# EAGLE design GPS_breakout-v10 (EAGLE 6.2)
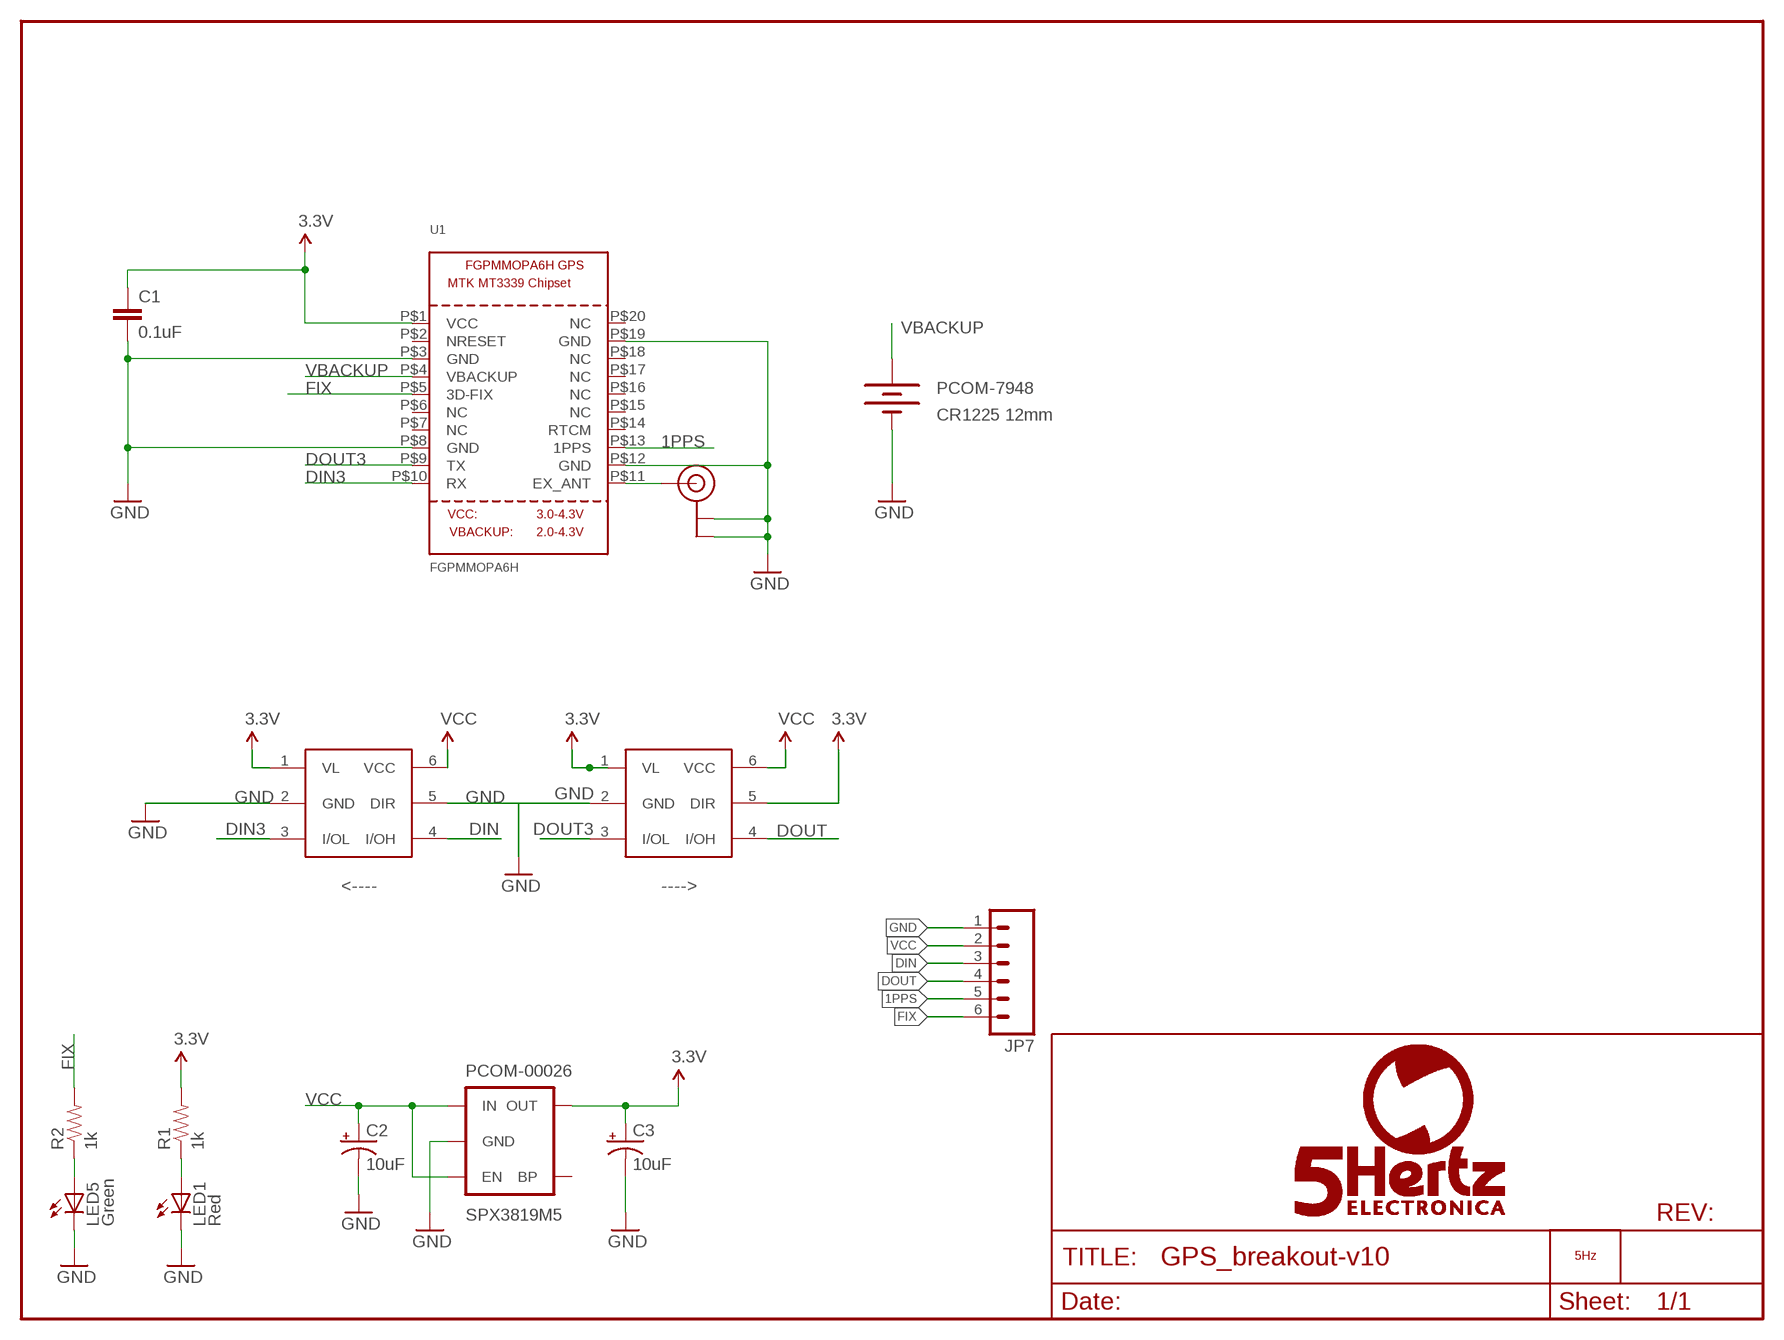
[diagram p0: schematic, sheet 1]

## Parts
C1  0.1uF  CAP0603-CAP  [0603-CAP]
C2  10uF  CAP_POL1206  [EIA3216]
C3  10uF  CAP_POL1206  [EIA3216]
JP7  M06SIP  [1X06]
LED1  Red  LED0603  [LED-0603]
LED5  Green  LED0603  [LED-0603]
LOGO1  LOGO_5HZ_MAIN_15MM  [5HZ_LOGO_MAIN_15MM]
PCOM-00026  SPX3819M5  V_REG_LDOSMD  [SOT23-5]
PCOM-7948  CR1225 12mm  BATTERY12PTH  [BATTCON_12MM_PTH]
R1  1k  RESISTOR0603-RES  [0603-RES]
R2  1k  RESISTOR0603-RES  [0603-RES]
U1  FGPMMOPA6H  GPS_FGPMMOPA6H  [FGPMMOPA6H]
U$7  MAX337  [SOT-363]
U$8  MAX337  [SOT-363]
U$20  U.FL  [U.FL]

## Nets
1PPS: JP7.5 U1.P$13(1PPS)
3.3V: C1.1 C3.A(+) PCOM-00026.5(OUT) R1.2 U1.P$1(VCC) U$7.1(VL) U$8.1(VL) U$8.5(DIR)
DIN: JP7.3 U$7.4(I/OH)
DIN3: U1.P$10(RX) U$7.3(I/OL)
DOUT: JP7.4 U$8.4(I/OH)
DOUT3: U1.P$9(TX) U$8.3(I/OL)
FIX: JP7.6 R2.2 U1.P$5(3D-FIX)
GND: C1.2 C2.C(-) C3.C(-) JP7.1 LED1.C LED5.C PCOM-00026.2(GND) PCOM-7948.GND(-) U1.P$3(GND) U1.P$8(GND) U1.P$12(GND) U1.P$19(GND) U$7.2(GND) U$7.5(DIR) U$8.2(GND) U$20.P$1(GND) U$20.P$2(GND)
N$1: LED1.A R1.1
N$7: U1.P$11(EX_ANT) U$20.P$3(SIGNAL)
N$139: LED5.A R2.1
VBACKUP: PCOM-7948.VCC@1(+) U1.P$4(VBACKUP)
VCC: C2.A(+) JP7.2 PCOM-00026.1(IN) PCOM-00026.3(EN) U$7.6(VCC) U$8.6(VCC)
Unconnected: PCOM-00026.4(BP) U1.P$2(NRESET) U1.P$6(NC) U1.P$7(NC) U1.P$14(RTCM) U1.P$15(NC) U1.P$16(NC) U1.P$17(NC) U1.P$18(NC) U1.P$20(NC)

## Notes on the sheet
- <---- | ---->

## Library data of the parts
C1 = 5hz-electronica:CAP: Capacitor Standard 0603 ceramic capacitor, and 0.1" leaded capacitor.
C2 C3 = SparkFun:CAP_POL: Capacitor Polarized These are standard SMD and PTH capacitors. Normally 10uF, 47uF, and 100uF in electrolytic and tantalum varieties. Always verify the external diameter of the through hole cap, it varies with capacity, voltage, and manufacturer. The EIA devices should be standard.
JP7 = SparkFun:M06: Header 6 Standard 6-pin 0.1" header. Use with straight break away headers (SKU : PRT-00116), right angle break away headers (PRT-00553), swiss pins (PRT-00743), machine pins (PRT-00117), and female headers (PRT-00115). Molex polarized connector foot print use with SKU : PRT-08094 with associated crimp pins and housings. NOTES ON THE VARIANTS LOCK and LOCK_LONGPADS... This footprint was designed to help hold the alignment of a through-hole component (i.e. 6-pin header) while soldering it into place. You may notice that each hole has been shifted either up or down by 0.005 of an inch from it's more standard position (which is a perfectly straight line). This slight alteration caused the pins (the squares in the middle) to touch the edges of the holes. Because they are alternating, it causes a "brace" to hold the component in place. 0.005 has proven to be the perfect amount of "off-center" position when using our standard breakaway headers. Although looks a little odd when you look at the bare footprint, once you have a header in there, the alteration is very hard to notice. Also, if you push a header all the way into place, it is covered up entirely on the bottom side. This idea of altering the position of holes to aid alignment will be further integrated into the Sparkfun Library for other footprints. It can help hold any component with 3 or more connection pins.
LED1 LED5 = SparkFun:LED: LEDs Standard schematic elements and footprints for 5mm, 3mm, 1206, and 0603 sized LEDs. 5mm - Spark Fun Electronics SKU : COM-00529 (and others)
LOGO1 = 5hz-electronica:LOGO_5HZ: Logotipo 5Hz "según Pedro"
PCOM-00026 = SparkFun:V_REG_LDO: Voltage Regulator LDO Standard 150mA LDO voltage regulator in SOT-23 layout. Micrel part MIC5205. BP (by-pass) pin is used to lower output noise with 470pF cap.
PCOM-7948 = SparkFun:BATTERY: Battery Holders Various common sizes : AA, AAA, 20mm coin cell and 12mm coin cell.
R1 R2 = SparkFun:RESISTOR: Resistor Basic schematic elements and footprints for 0603, 1206, and PTH resistors.
U1 = microbuilder:GPS_FGPMMOPA6H: GPS Module - MTK MT3339 Chipset, -165dBm sensitivity, 22 channels, 10Hz, auto-select external antenna options
U$7 U$8 = 74LVCH1T45:MAX337
U$20 = microbuilder:U.FL: U.FL Antenna Connector

## Board
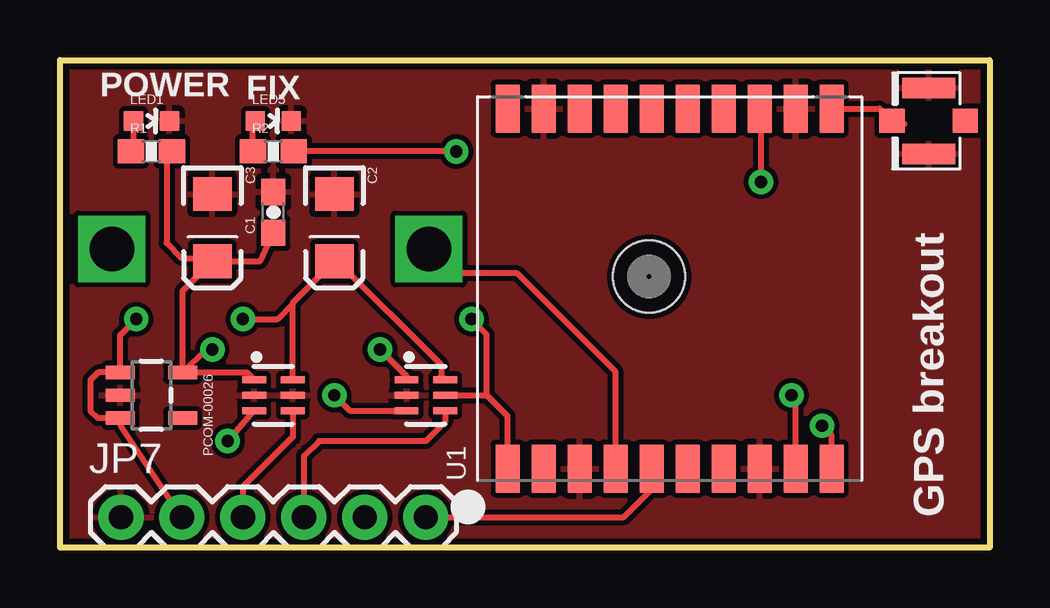
[diagram p1: board, top side]
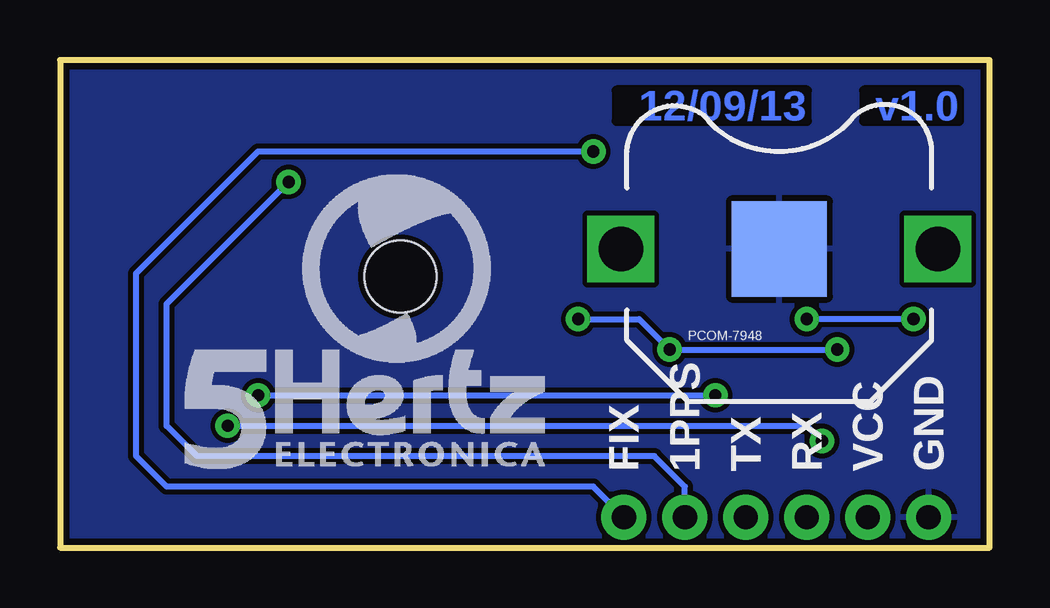
[diagram p2: board, bottom side, seen from below]

Size 38.73 x 20.32 mm. Coordinates in mm from the lower left corner, seen from the top.
Outline: 0,0 0,20.32 38.73,20.32 38.73,0 0,0
Copper layers (1*16): Top 0.035mm / dielectric 1.5mm / Bottom 0.035mm
Design rules: minimum track width 8mil, minimum drill 20mil, track to track 8mil, track to pad 8mil, pad to pad 8mil, via to via 8mil, smd to smd 8mil, copper to edge 10mil, drill to drill 8mil, minimum pad ring 12mil, minimum via ring 10mil, stop-mask expansion 4mil, vias tented up to drill 25mil, thermal gap 10mil

### Footprints (pad centres in the part's own frame; a part is rotated, then mirrored left to right if it is on the bottom)
0603-CAP = smd 1.1 x 1: 1 -0.85,0; 2 0.85,0
EIA3216 = smd 1.4 x 1.6: A 1.4,0; C -1.4,0
1X06 = drill 1.016 pad 1.88: 1 0,0; 2 2.54,0; 3 5.08,0; 4 7.62,0; 5 10.16,0; 6 12.7,0
LED-0603 = smd 0.8 x 0.8: A 0,-0.75; C 0,0.75
SOT23-5 = smd 0.55 x 1.2: 1 -0.95,-1.3; 2 0,-1.3; 3 0.95,-1.3; 4 0.95,1.3; 5 -0.95,1.3
BATTCON_12MM_PTH = smd 3.962 x 3.962: GND 0,0 | drill 1.854 square: VCC@1 -6.604,0; VCC@2 6.604,0
0603-RES = smd 1.1 x 1: 1 -0.85,0; 2 0.85,0
FGPMMOPA6H = smd 2 x 1: P$1 -7.5,6.75; P$2 -7.5,5.25; P$3 -7.5,3.75; P$4 -7.5,2.25; P$5 -7.5,0.75; P$6 -7.5,-0.75; P$7 -7.5,-2.25; P$8 -7.5,-3.75; P$9 -7.5,-5.25; P$10 -7.5,-6.75; P$11 7.5,-6.75; P$12 7.5,-5.25; P$13 7.5,-3.75; P$14 7.5,-2.25; P$15 7.5,-0.75; P$16 7.5,0.75; P$17 7.5,2.25; P$18 7.5,3.75; P$19 7.5,5.25; P$20 7.5,6.75 | hole 3: 0.5,0.85
SOT-363 = smd 0.3 x 0.99: 1 -0.65,-0.8; 2 0,-0.8; 3 0.65,-0.8; 4 0.65,0.81; 5 0,0.81; 6 -0.65,0.81
U.FL = smd 2.2 x 0.85: P$1 0,1.375; P$2 0,-1.375 | smd 1.05 x 1: P$3 1.525,0; P$4 -1.525,0

### Placement (x,y rotation side)
C1  8.89,13.97 90 top
C2  11.43,13.33 270 top
C3  6.35,13.33 270 top
JP7  2.54,1.27 0 top
LED1  3.81,17.78 270 top
LED5  8.89,17.78 270 top
LOGO1  33.53,3.3 0 bottom
PCOM-00026  3.81,6.35 270 top
PCOM-7948  8.76,12.45 0 bottom
R1  3.81,16.51 0 top
R2  8.89,16.51 0 top
U1  25.4,10.79 90 top
U$7  8.89,6.35 270 top
U$8  15.24,6.35 270 top
U$20  36.2,17.78 180 top

### Tracks (layer width: path | path; a pad name or v marks a point on that pad's centre or on a via)
1PPS  (via drill 0.51)
  Top 0.254: v29.21,15.24 29.21,18.24 U1.P$13
  Bottom 0.254: JP7.5 12.7,2.54 13.97,3.81 33.02,3.81 34.29,5.08 34.29,10.16 v29.21,15.24
3.3V  (via drill 0.51)
  Top 0.254: C3.A 8.34,11.93 C1.1 | U1.P$1 18.65,5.48 17.78,6.35 | PCOM-00026.5 5.11,10.7 C3.A | C3.A 6.22,12.06 5.08,12.06 4.45,12.7 4.45,16.3 R1.2 | PCOM-00026.5 7.79,7.3 U$7.1 | U$8.1 14.44,7.15 v13.34,8.25 | v6.35,8.25 6.07,8.25 PCOM-00026.5 | U$8.5 17.78,6.35 | 17.78,6.35 17.78,8.89 v17.14,9.53
  Bottom 0.254: v6.35,8.25 v13.34,8.25 14.61,9.53 v17.14,9.53
DIN
  Top 0.254: U$7.4 9.7,4.62 7.62,2.54 JP7.3
DIN3  (via drill 0.51)
  Top 0.254: U1.P$10 32.15,4.68 v31.75,5.08 | v6.99,4.45 8.07,5.71 U$7.3
  Bottom 0.254: v31.75,5.08 7.62,5.08 v6.99,4.45
DOUT
  Top 0.254: U$8.4 16.05,5.25 15.24,4.45 10.79,4.45 10.16,3.81 JP7.4
DOUT3  (via drill 0.51)
  Top 0.254: U1.P$9 30.65,6.18 v30.48,6.35 | v11.43,6.35 12.06,5.71 14.43,5.71 U$8.3
  Bottom 0.254: v30.48,6.35 v11.43,6.35
FIX  (via drill 0.51)
  Top 0.254: JP7.6 23.5,1.27 24.77,2.54 24.77,3.18 U1.P$5 | v16.51,16.51 R2.2
  Bottom 0.254: JP7.6 16.51,2.54 34.29,2.54 35.56,3.81 35.56,11.43 30.48,16.51 v16.51,16.51
GND
  pour Bottom: 38.73,0 0,0 0,20.32 38.73,20.32
  pour Top: 0,0 0,20.32 38.73,20.32 38.73,0
N$1
  Top 0.254: LED1.A 3.06,16.61 R1.1
N$7
  Top 0.254: 35.19,17.66 U$20.P$3 34.16,18.3 U1.P$11
N$139
  Top 0.254: R2.1 8.04,17.68 LED5.A
VBACKUP
  Top 0.254: U1.P$4 23.15,7.33 19.05,11.43 16.38,11.43 PCOM-7948.VCC@1
VCC  (via drill 0.51)
  Top 0.254: JP7.2 2.54,5.08 2.54,5.37 PCOM-00026.3 1.58,5.4 1.27,5.71 1.27,6.98 1.58,7.3 PCOM-00026.1 2.51,8.86 v3.17,9.53 | U$7.6 9.7,10.16 | 9.7,10.16 9.7,10.21 C2.A 11.56,11.93 15.88,7.62 15.88,7.17 U$8.6 | v7.62,9.53 9.06,9.53 9.7,10.16
  Bottom 0.254: v3.17,9.53 v7.62,9.53

### Text on the board
Bottom: v1.0 | 12/09/13
tPlace: POWER | FIX | GPS breakout
bPlace: GND | VCC | RX | TX | 1PPS | FIX